# Altium schematic sheet rv_ledbrick_logic.SchDoc
size A4; SheetNumber: 3; SheetTotal: 6
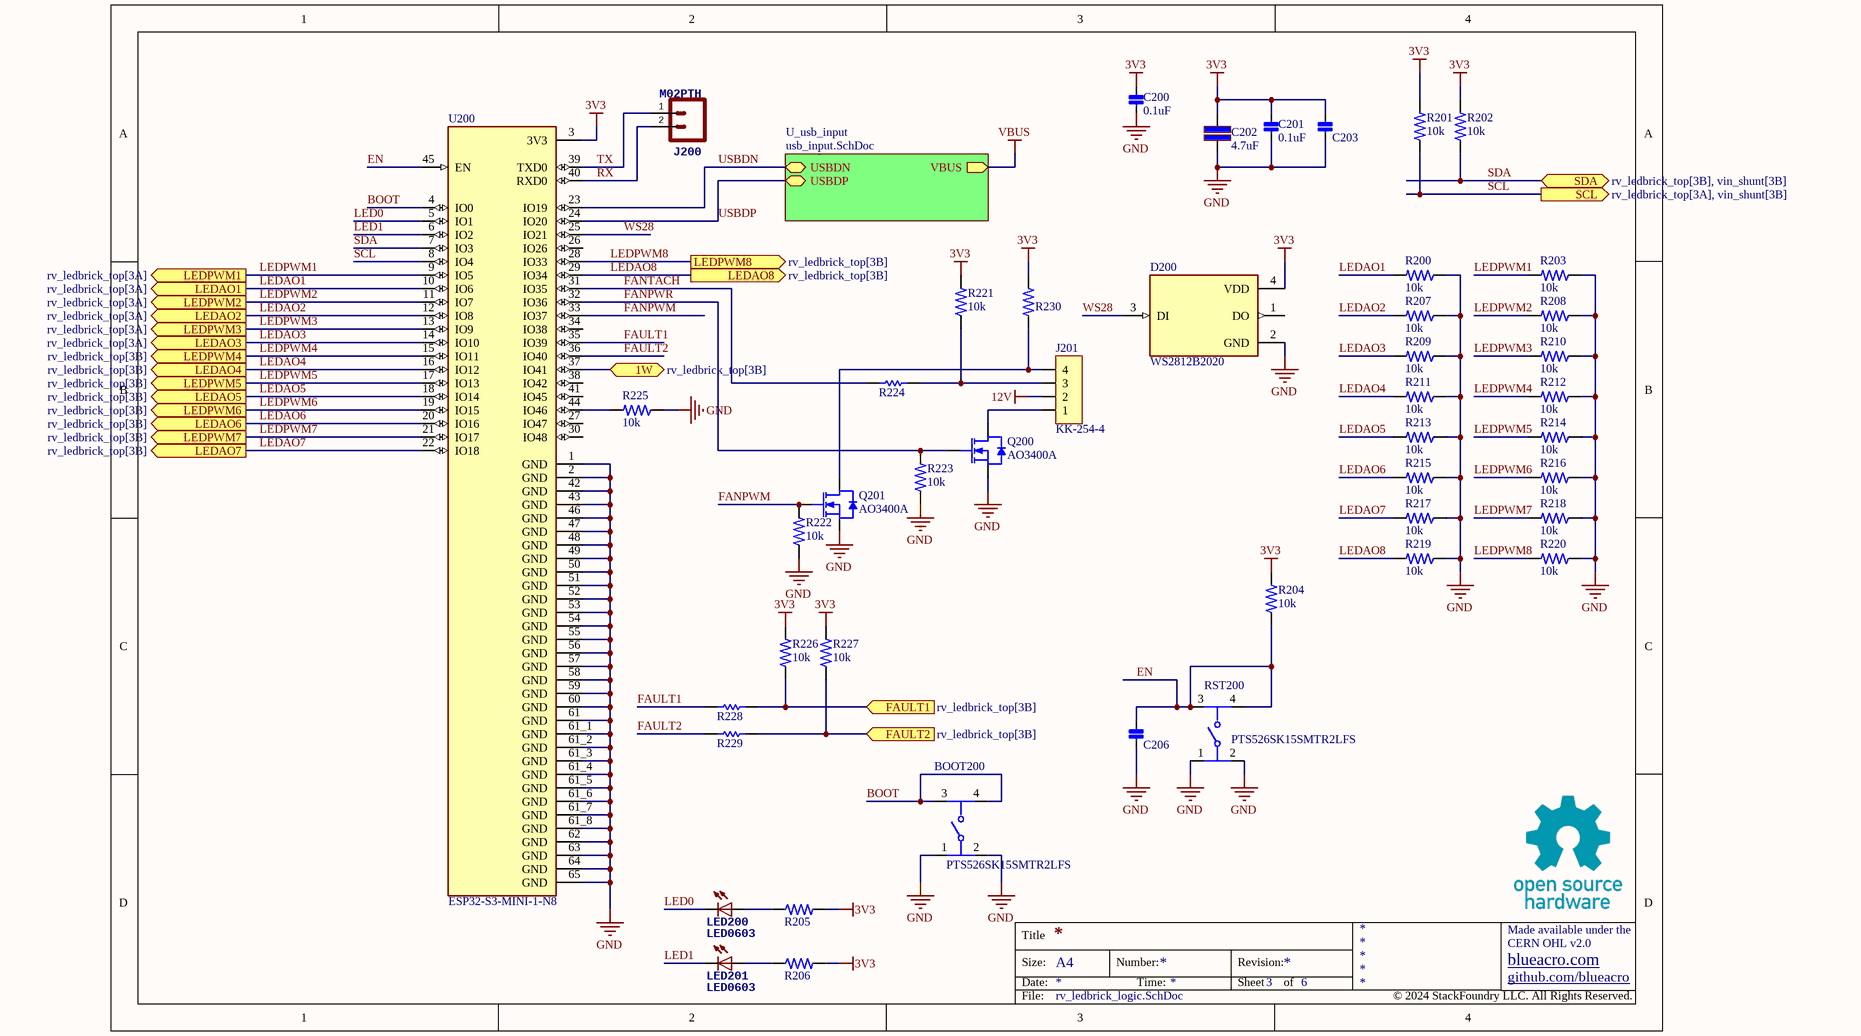
[diagram p0: rv_ledbrick_logic.SchDoc]

## Parts
BOOT200  PTS526SK15SMTR2LFS  [FP-PTS526SK15SMTR2LFS-MFG]
C200  value 0.1uF  [FP-CL10-IPC_B]  (hidden comment: CAP 0.1uF 50V X7R 0603)
C201  value 0.1uF  [FP-CL10-IPC_B]  (hidden comment: CAP 0.1uF 50V X7R 0603)
C202  value 4.7uF  [CAPC3225X20N]  (hidden comment: CAP 4.7uF 50V X7R 1210)
C203  CAP 1uF 10V X7R 0603  [FP-CL10-IPC_B]  (value not drawn)
C206  CAP 1uF 10V X7R 0603  [FP-CL10-IPC_B]  (value not drawn)
D200  WS2812B2020  [LED_WS2812B2020]
J200  M02PTH  [1X02]
J201  KK-254-4  [KK-254-47053-3000]
LED200  LED0603  [LED-0603]
LED201  LED0603  [LED-0603]
Q200  AO3400A  [SOT23-3]
Q201  AO3400A  [SOT23-3]
R200  value 10k  [RESC1608-IPC-NL]  (hidden comment: 10K 0603 1%)
R201  value 10k  [RESC1608-IPC-ML]  (hidden comment: 10K 0603 1%)
R202  value 10k  [RESC1608-IPC-ML]  (hidden comment: 10K 0603 1%)
R203  value 10k  [RESC1608-IPC-NL]  (hidden comment: 10K 0603 1%)
R204  value 10k  [RESC1608-IPC-ML]  (hidden comment: 10K 0603 1%)
R205  1K 0603 1%  [RESC1608-IPC-ML]  (value not drawn)
R206  1K 0603 1%  [RESC1608-IPC-ML]  (value not drawn)
R207  value 10k  [RESC1608-IPC-NL]  (hidden comment: 10K 0603 1%)
R208  value 10k  [RESC1608-IPC-NL]  (hidden comment: 10K 0603 1%)
R209  value 10k  [RESC1608-IPC-NL]  (hidden comment: 10K 0603 1%)
R210  value 10k  [RESC1608-IPC-NL]  (hidden comment: 10K 0603 1%)
R211  value 10k  [RESC1608-IPC-NL]  (hidden comment: 10K 0603 1%)
R212  value 10k  [RESC1608-IPC-NL]  (hidden comment: 10K 0603 1%)
R213  value 10k  [RESC1608-IPC-NL]  (hidden comment: 10K 0603 1%)
R214  value 10k  [RESC1608-IPC-NL]  (hidden comment: 10K 0603 1%)
R215  value 10k  [RESC1608-IPC-NL]  (hidden comment: 10K 0603 1%)
R216  value 10k  [RESC1608-IPC-NL]  (hidden comment: 10K 0603 1%)
R217  value 10k  [RESC1608-IPC-NL]  (hidden comment: 10K 0603 1%)
R218  value 10k  [RESC1608-IPC-NL]  (hidden comment: 10K 0603 1%)
R219  value 10k  [RESC1608-IPC-NL]  (hidden comment: 10K 0603 1%)
R220  value 10k  [RESC1608-IPC-NL]  (hidden comment: 10K 0603 1%)
R221  value 10k  [RESC1608-IPC-ML]  (hidden comment: 10K 0603 1%)
R222  value 10k  [RESC1608-IPC-ML]  (hidden comment: 10K 0603 1%)
R223  value 10k  [RESC1608-IPC-ML]  (hidden comment: 10K 0603 1%)
R224  10R 0603 1%  [RESC1608-IPC-NL]  (value not drawn)
R225  value 10k  [RESC1608-IPC-NL]  (hidden comment: 10K 0603 1%)
R226  value 10k  [RESC1608-IPC-ML]  (hidden comment: 10K 0603 1%)
R227  value 10k  [RESC1608-IPC-ML]  (hidden comment: 10K 0603 1%)
R228  10R 0603 1%  [RESC1608-IPC-NL]  (value not drawn)
R229  10R 0603 1%  [RESC1608-IPC-NL]  (value not drawn)
R230  1K 0603 1%  [RESC1608-IPC-ML]  (value not drawn)
RST200  PTS526SK15SMTR2LFS  [FP-PTS526SK15SMTR2LFS-MFG]
U200  ESP32-S3-MINI-1-N8  [XCVR_ESP32-S3-MINI-1-N8]

## Sub-sheets
U_usb_input = usb_input.SchDoc: USBDN (bidir), USBDP (bidir), VBUS (out)

## Ports
1W (bidir, see rv_ledbrick_top[3B]), FAULT1 (in, see rv_ledbrick_top[3B]), FAULT2 (in, see rv_ledbrick_top[3B]), LEDAO1 (out, see rv_ledbrick_top[3A]), LEDAO2 (out, see rv_ledbrick_top[3A]), LEDAO3 (out, see rv_ledbrick_top[3A]), LEDAO4 (out, see rv_ledbrick_top[3B]), LEDAO5 (out, see rv_ledbrick_top[3B]), LEDAO6 (out, see rv_ledbrick_top[3B]), LEDAO7 (out, see rv_ledbrick_top[3B]), LEDAO8 (out, see rv_ledbrick_top[3B]), LEDPWM1 (out, see rv_ledbrick_top[3A]), LEDPWM2 (out, see rv_ledbrick_top[3A]), LEDPWM3 (out, see rv_ledbrick_top[3A]), LEDPWM4 (out, see rv_ledbrick_top[3B]), LEDPWM5 (out, see rv_ledbrick_top[3B]), LEDPWM6 (out, see rv_ledbrick_top[3B]), LEDPWM7 (out, see rv_ledbrick_top[3B]), LEDPWM8 (out, see rv_ledbrick_top[3B]), SCL (out, see rv_ledbrick_top[3A], vin_shunt[3B]), SDA (bidir, see rv_ledbrick_top[3B], vin_shunt[3B])

## Nets
3V3: C200.1 C201.1 C202.2 C203.1 D200.4(VDD) R201.2 R202.2 R204.2 R205.2 R206.2 R221.2 R226.2 R227.2 R230.2 U200.3(3V3)
12V: J201.2
GND: BOOT200.1 BOOT200.2 C200.2 C201.2 C202.1 C203.2 C206.2 D200.2(GND) Q200.2(S) Q201.2(S) R200.1 R203.1 R207.1 R208.1 R209.1 R210.1 R211.1 R212.1 R213.1 R214.1 R215.1 R216.1 R217.1 R218.1 R219.1 R220.1 R222.1 R223.1 R225.1 RST200.1 RST200.2 U200.1(GND) U200.2(GND) U200.42(GND) U200.43(GND) U200.46(GND) U200.47(GND) U200.48(GND) U200.49(GND) U200.50(GND) U200.51(GND) U200.52(GND) U200.53(GND) U200.54(GND) U200.55(GND) U200.56(GND) U200.57(GND) U200.58(GND) U200.59(GND) U200.60(GND) U200.61(GND) U200.61_1(GND) U200.61_2(GND) U200.61_3(GND) U200.61_4(GND) U200.61_5(GND) U200.61_6(GND) U200.61_7(GND) U200.61_8(GND) U200.62(GND) U200.63(GND) U200.64(GND) U200.65(GND)
VBUS: sheet U_usb_input/VBUS
1W: U200.37(IO41) ; port 1W
BOOT: BOOT200.3 BOOT200.4 U200.4(IO0)
EN: C206.1 R204.1 RST200.3 RST200.4 U200.45(EN)
FANPWM: Q201.1(G) R222.2 U200.33(IO37)
FANPWR: Q200.1(G) R223.2 U200.32(IO36)
FANTACH: R224.1 U200.31(IO35)
FAULT1: R228.1 U200.35(IO39)
FAULT1: R226.1 R228.2 ; port FAULT1  [a separate net that carries the same name]
FAULT2: R229.1 U200.36(IO40)
FAULT2: R227.1 R229.2 ; port FAULT2  [a separate net that carries the same name]
LED0: LED200.C U200.5(IO1)
LED1: LED201.C U200.6(IO2)
LEDAO1: R200.2 U200.10(IO6) ; port LEDAO1
LEDAO2: R207.2 U200.12(IO8) ; port LEDAO2
LEDAO3: R209.2 U200.14(IO10) ; port LEDAO3
LEDAO4: R211.2 U200.16(IO12) ; port LEDAO4
LEDAO5: R213.2 U200.18(IO14) ; port LEDAO5
LEDAO6: R215.2 U200.20(IO16) ; port LEDAO6
LEDAO7: R217.2 U200.22(IO18) ; port LEDAO7
LEDAO8: R219.2 U200.29(IO34) ; port LEDAO8
LEDPWM1: R203.2 U200.9(IO5) ; port LEDPWM1
LEDPWM2: R208.2 U200.11(IO7) ; port LEDPWM2
LEDPWM3: R210.2 U200.13(IO9) ; port LEDPWM3
LEDPWM4: R212.2 U200.15(IO11) ; port LEDPWM4
LEDPWM5: R214.2 U200.17(IO13) ; port LEDPWM5
LEDPWM6: R216.2 U200.19(IO15) ; port LEDPWM6
LEDPWM7: R218.2 U200.21(IO17) ; port LEDPWM7
LEDPWM8: R220.2 U200.28(IO33) ; port LEDPWM8
RX: J200.2 U200.40(RXD0)
SCL: R201.1 U200.8(IO4) ; port SCL
SDA: R202.1 U200.7(IO3) ; port SDA
TX: J200.1 U200.39(TXD0)
USBDN: U200.23(IO19) ; sheet U_usb_input/USBDN
USBDP: U200.24(IO20) ; sheet U_usb_input/USBDP
WS28: D200.3(DI) U200.25(IO21)
NetJ201_1: J201.1 Q200.3(D)
NetJ201_3: J201.3 R221.1 R224.2
NetJ201_4: J201.4 Q201.3(D) R230.1
NetLED200_A: LED200.A R205.1
NetLED201_A: LED201.A R206.1
NetR225_2: R225.2 U200.44(IO46)

Not connected (* = marked no-connect by the designer): D200 1(DO); U200 26(IO26) 27(IO47) 30(IO48) 34(IO38) 38(IO42) 41(IO45)

## Notes on the sheet
- Title
- Size:
- Date:
- A4
- Number:
- Time:
- Revision:
- Sheet
- of
- github.com/blueacro
- blueacro.com
- CERN OHL v2.0
- Made available under the
- File:
- © 2024 StackFoundry LLC. All Rights Reserved.

## Library data of the parts
BOOT200 RST200 = CMP-011-00015-1: Switch Tactile N.O. SPST Round Button Gull Wing 0.05A 12VDC 200000Cycles 2.45N SMD T/R; Contact Current Rating: 50mA; Illumination Type: Non-Illuminated; Contact Resistance: 100mR; Number of Positions: 2; Switch Function: Off-Mom; Actuator Type: Standard; Operating Force: 260gf; Voltage Rating (DC): 12V; Ratings: IP40; Switch Travel: 0.25mm; Max Operating Temperature: 70°C; Mechanical Life: 200000Cycles; Termination: Gull Wing; Throw Configuration: SPST; Series: PTS526; Height: 1.65mm; Mounting Technology: Surface Mount; Min Operating Temperature: -20°C
C200 C201 = CMP-001-00084-7: Cap Ceramic 0.1uF 50V X7R 20% SMD 0603 125C Paper T/R; Voltage: 50V
C202 = CMP-001-00083-3: CAP CER 4.7UF 50V X7R 1210; Tolerance: 10%; Material: Ceramic; Voltage: 50V; Capacitance: 4.7uF; Width: 0.098inch; Height: 1.8mm; Depth: 2.5mm; Package Quantity: 1; Case/Package: 1210; Case Code (Imperial): 1210; Contact Plating: Tin; Thickness: 0.079inch; Radiation Hardening: No; Voltage Rating: 50V; Packaging: Tape and Reel; Lead Free: Lead Free; Dielectric: X7R; Min Operating Temperature: -55°C; Case Code (Metric): 3225; Max Operating Temperature: 125°C; Mount: Surface Mount; Length: 3.2mm
C203 C206 = CMP-001-00085-7: Cap Ceramic 1uF 10V X7R 10% SMD 0603 125C Paper T/R
D200 = CMP-004-00042-1: LED; SMD; 2020; RGB; 2x2x0.84mm; 3.7Ã·5.3V; Lens: transparent; 2kHz; MF: WorldSemi; Source: WS2812B2020.SchLib; Component Type: Standard; Pins: 4; Case/Package: None; SnapEDA_Link: https://www.snapeda.com/parts/WS2812B2020/Worldsemi/view-part/?ref=snap; Value: *; MP: WS2812B2020; Design Item ID: WS2812B2020; Check_prices: https://www.snapeda.com/parts/WS2812B2020/Worldsemi/view-part/?ref=eda
J200 = CMP-166-0010-1: Source: con-headers.SCHLIB; Design Item ID: M02PTH
J201 = CMP-133-0002-3: KK 254 Vertical Header, with Friction Lock, 4 Circuits, PC Tail Length: 4.00mm; Source: con-molex.SCHLIB; Contact Mating Length: 0.289inch; Color: Beige; Contact Material: Copper Alloy; Contact Plating: Tin; Design Item ID: KK-254-4
LED200 LED201 = CMP-130-0000-1: Source: led.SchLib; Design Item ID: LED0603
Q200 Q201 = CMP-094-0000-1: Design Item ID: NFET; Source: fet.SchLib
R200-R204 R207-R223 R225-R227 = CMP-009-00191-4: Res General Purpose Thick Film 0603 10K Ohm 1% 1/10W ±100ppm/°C Molded SMD Paper T/R
R205 R206 R230 = CMP-009-00193-3: Res Thick Film 0603 1K Ohm 1% 1/10W ±100ppm/°C Molded SMD Punched Carrier T/R
R224 R228 R229 = CMP-009-00180-2: YAGEO (PHYCOMP) - RC0603FR-0710RL - RES, THICK FILM, 10R, 1%, 0.1W, 0603; Voltage Rating: 50V; Power Rating: 100mW; Temperature Coefficient: 200ppm/°C; Resistor Type: Thick Film; Width: 0.8mm; Max Operating Temperature: 155°C; Tolerance: 1%; Radiation Hardening: No; Packaging: Tape and Reel; Case Code (Imperial): 0603; Min Operating Temperature: -55°C; Termination: SMD/SMT; Length: 1.6mm; Military Standard: Not; Case Code (Metric): 1608; Contact Plating: Tin,Matte; Height: 0.45mm; REACH SVHC: No SVHC; Voltage Rating (DC): 50V; Number of Pins: 2; Depth: 0.8mm; Lead Free: Lead Free; Resistance: 10R; Case/Package: 0603
U200 = CMP-247-000000-1: Bluetooth, WiFi 802.11b/g/n, Bluetooth v5.0 Transceiver Module 2.4GHz PCB Trace Surface Mount; MF: Espressif Systems; Source: ESP32-S3-MINI-1-N8.SchLib; Check_prices: https://www.snapeda.com/parts/ESP32-S3-MINI-1-N8/Espressif+Systems/view-part/?ref=eda; Purchase-URL: https://pricing.snapeda.com/search?q=ESP32-S3-MINI-1-N8&ref=eda; MP: ESP32-S3-MINI-1-N8; Value: *; SnapEDA_Link: https://www.snapeda.com/parts/ESP32-S3-MINI-1-N8/Espressif+Systems/view-part/?ref=snap; Package: None; Pin Count: 73; Design Item ID: ESP32-S3-MINI-1-N8; Price: None; Component Type: Standard; Availability: In Stock